# Altium schematic sheet gate_driver.SchDoc
size A4; Author: Omri Nissan; Organization: Altium Limited; Address1: -; Address2: San Luis Obispo; Address3: California, 93401; Address4: United States; DocumentNumber: 7; SheetNumber: 7; SheetTotal: 8
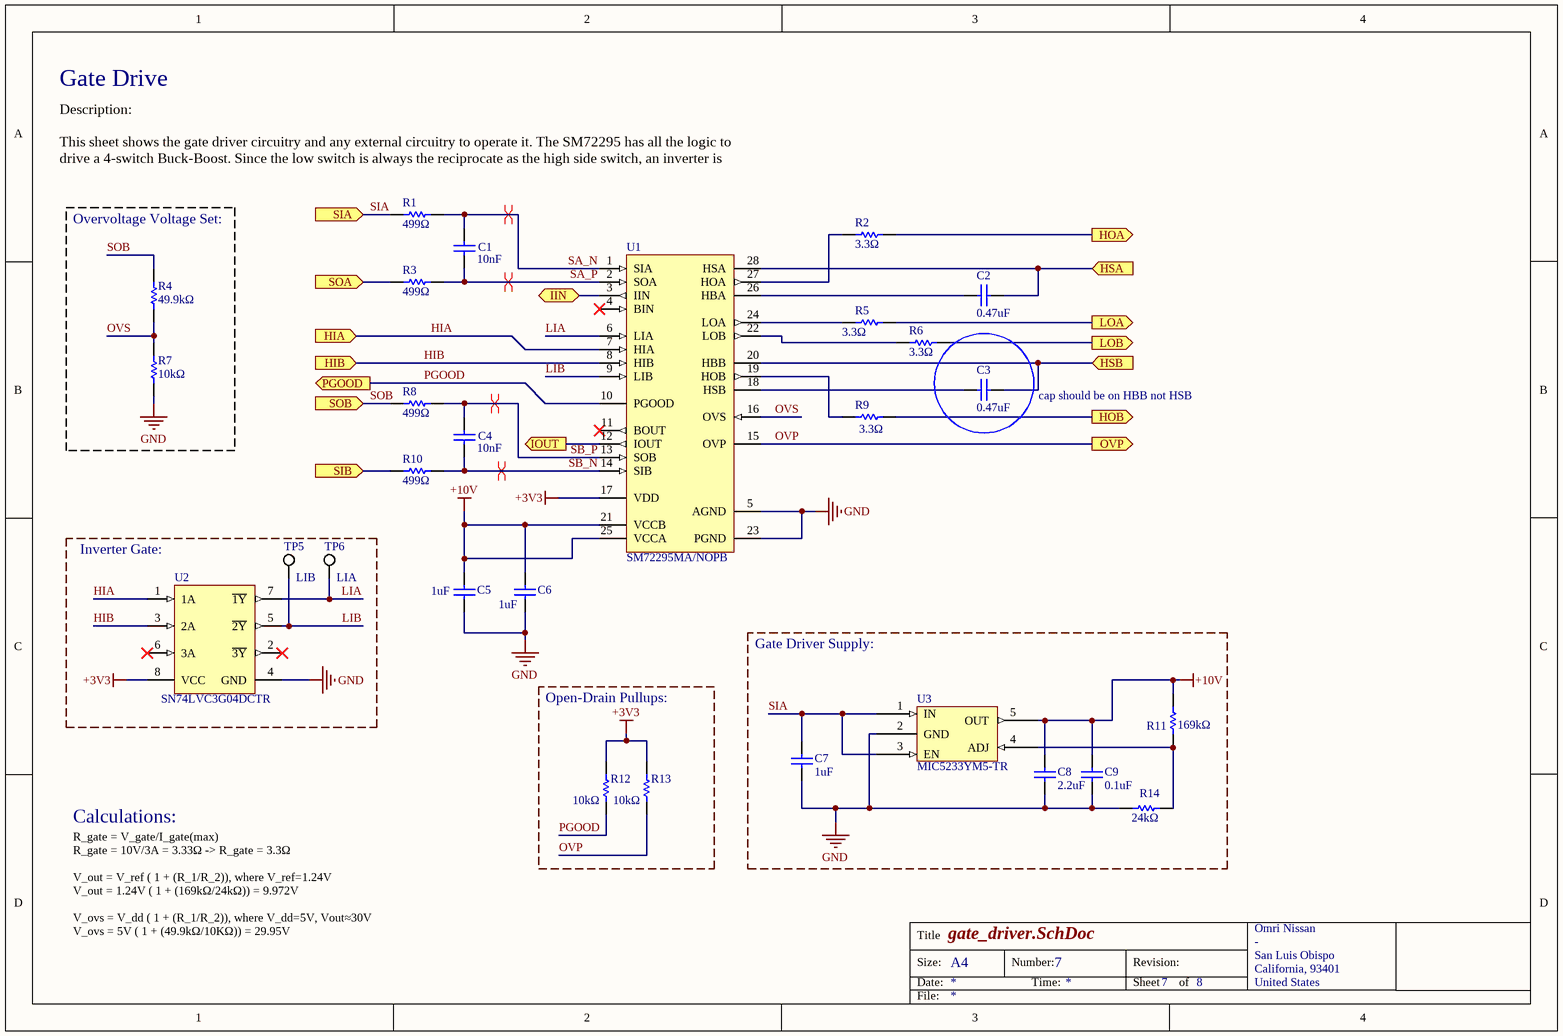
[diagram p0: gate_driver.SchDoc]

## Parts
C1  10nF  [CAPC1608X90X40ML10T20]
C2  0.47uF  [CAPC2013X110X50NL20T25]
C3  0.47uF  [CAPC2013X110X50NL20T25]
C4  10nF  [CAPC1608X90X40ML10T20]
C5  1uF  [CAPC1608X90X20LL10]
C6  1uF  [CAPC1608X90X20LL10]
C7  1uF  [CAPC1608X90X20LL10]
C8  2.2uF  [CAPC2013X145X20LL20]
C9  0.1uF  [CAPC1608X90X35ML10T15]
R1  499Ω  [RESC1608X55X30LL20T20]
R2  3.3Ω  [RESC1609X50X30LL10T20]
R3  499Ω  [RESC1608X55X30LL20T20]
R4  49.9kΩ  [RESC1608X55X30ML15T15]
R5  3.3Ω  [RESC1609X50X30LL10T20]
R6  3.3Ω  [RESC1609X50X30LL10T20]
R7  10kΩ  [RESC1609X55X30LL15T15]
R8  499Ω  [RESC1608X55X30LL20T20]
R9  3.3Ω  [RESC1609X50X30LL10T20]
R10  499Ω  [RESC1608X55X30LL20T20]
R11  169kΩ  [RESC1608X55X30ML15T15]
R12  10kΩ  [RESC1609X55X30LL15T15]
R13  10kΩ  [RESC1609X55X30LL15T15]
R14  24kΩ  [RESC1609X50X30NL10T20]
TP5  LIB  [KSTN-5012_V]
TP6  LIA  [KSTN-5012_V]
U1  SM72295MA/NOPB  [DW0028A_N]
U2  SN74LVC3G04DCTR  [TI-DCT8_V]
U3  MIC5233YM5-TR  [MF05A_L]

## Blocks framed on the sheet
Overvoltage Voltage Set:: R4 R7
Inverter Gate:: TP5 TP6 U2
Gate Driver Supply:: C7-C9 R11 R14 U3
Open-Drain Pullups:: R12 R13

## Ports
HIA (in), HIB (in), HOA (out), HOB (out), HSA (in), HSB (in), IIN (bidir), IOUT (out), LOA (out), LOB (out), OVP (out), PGOOD (out), SIA (in), SIB (in), SOA (in), SOB (in)

## Nets
+3V3: R12.2 R13.2 U1.17(VDD) U2.8(VCC)
+10V: C5.1 C6.1 C8.2 C9.2 R11.2 U1.21(VCCB) U1.25(VCCA) U3.5(OUT)
GND: C5.2 C6.2 C7.2 C8.1 C9.1 R7.1 R14.2 U1.5(AGND) U1.23(PGND) U2.4(GND) U3.2(GND)
HIA: U1.7(HIA) U2.1(1A) ; port HIA
HIB: U1.8(HIB) U2.3(2A) ; port HIB
HOA: R2.2 ; port HOA
HOB: R9.2 ; port HOB
HSA: C2.2 U1.28(HSA) ; port HSA
HSB: C3.2 U1.20(HBB) ; port HSB
IIN: U1.3(IIN) ; port IIN
IOUT: U1.12(IOUT) ; port IOUT
LIA: TP6.1 U1.6(LIA) U2.7(~{1Y})
LIB: TP5.1 U1.9(LIB) U2.5(~{2Y})
LOA: R5.2 ; port LOA
LOB: R6.2 ; port LOB
OVP: R13.1 U1.15(OVP) ; port OVP
OVS: R4.1 R7.2 U1.16(OVS)
PGOOD: R12.1 U1.10(PGOOD) ; port PGOOD
SA_N: C1.2 R1.2 U1.1(SIA)
SA_P: C1.1 R3.2 U1.2(SOA)
SB_N: C4.1 R10.2 U1.14(SIB)
SB_P: C4.2 R8.2 U1.13(SOB)
SIA: C7.1 R1.1 U3.1(IN) U3.3(EN) ; port SIA
SIB: R10.1 ; port SIB
SOA: R3.1 ; port SOA
SOB: R4.2 R8.1 ; port SOB
NetC2_1: C2.1 U1.26(HBA)
NetC3_1: C3.1 U1.18(HSB)
NetR2_1: R2.1 U1.27(HOA)
NetR5_1: R5.1 U1.24(LOA)
NetR6_1: R6.1 U1.22(LOB)
NetR9_1: R9.1 U1.19(HOB)
NetR11_1: R11.1 R14.1 U3.4(ADJ)

Not connected (* = marked no-connect by the designer): U1 4(BIN)* 11(BOUT)*; U2 2(~{3Y})* 6(3A)*

## Layout directives
differential pair: SA_N, SA_P, SB_N, SB_P

## Notes on the sheet
- Gate Drive
- Description:
  This sheet shows the gate driver circuitry and any external circuitry to operate it. The SM72295 has all the logic to drive a 4-switch Buck-Boost. Since the low switch is always the reciprocate as the high side switch, an inverter is used to drive the low side switches.
- (near C3) cap should be on HBB not HSB
- Calculations:
- R_gate = V_gate/I_gate(max)
  R_gate = 10V/3A = 3.33Ω -> R_gate = 3.3Ω
  V_out = V_ref ( 1 + (R_1/R_2)), where V_ref=1.24V
  V_out = 1.24V ( 1 + (169kΩ/24kΩ)) = 9.972V
  V_ovs = V_dd ( 1 + (R_1/R_2)), where V_dd=5V, Vout≈30V
  V_ovs = 5V ( 1 + (49.9kΩ/10KΩ)) = 29.95V
- Title
- Size:
- Date:
- A4
- Number:
- Time:
- Revision:
- Sheet
- of
- File:

## Library data of the parts
C1 C4 = CMP-2100-03600-1: CC0603KRX7R9BB103 - Chip Capacitor, 10 nF, +/- 10%, 50 V, -55 to 125 degC, 0603 (1608 Metric), RoHS, Tape and Reel; Manufacturer: Yageo; Insulation Resistance: 100GR; Dielectric: X7R; Voltage Rating (DC): 50V; Material: Ceramic; Lead Free: LeadFree; Case/Package: 0603; Datasheet Version: Rev. 15, 10/2016; Composition: Ceramic; Radiation Hardening: No; Thickness: 0.035inch; RoHSCompliant: True; Termination: SMD/SMT; Capacitance: 10nF; Manufacturer URL: http://www.yageo.com/; Tolerance: 10%; REACH SVHC: NoSVHC; Voltage: 50V; Max Operating Temperature: 125degC; Case Code (Metric): 1608; Package Quantity: 1; Case Code (Imperial): 0603; Packaging: TapeandReel; Package Reference: 0603; Width: 0.031inch; Datasheet URL: http://www.yageo.com/documents/recent/UPY-GPHC_X7R_6.3V-to-50V_15.pdf; Length: 1.6mm; Min Operating Temperature: -55degC; Number of Pins: 2; Depth: 0.8mm; Mount: SurfaceMount; Height: 0.8mm; Voltage Rating: 50V; Package Description: 2-Pin Surface Mount Device, Body 1.6 x 0.8 mm
C2 C3 = CMP-2007-03659-1: C0805C474K5RACTU; Manufacturer: Kemet; Part Number: C0805C474K5RACTU
C5-C7 = CMP-2000-06025-1: C1608X5R1H105K080AB- Chip Capacitor, 1 uF, +/- 10%, 50 V, -55 to 85 degC, 0603 (1608 Metric), RoHS, Tape and Reel; Manufacturer: TDK; PCN Part Number: MLCCPartNumberChange30/Nov/2012; Other Names: 445-7468-6; Online Catalog: CSeries,GeneralPurpose; Capacitance: 1µF; Product Training Modules: CSeriesGeneralApplicationsSEAT,CCV,andTVCLDesignToolsGuidetoReplacinganElectrolyticCapacitorwithanMLCC; Voltage - Rated: 50V; Design Resources: 20WNon-IsolatedBuckLEDDriverUsingPLLNK460KG; Temperature Coefficient: X5R; Series: C; Datasheet Version: 08/2016; Package Description: 2-Pin Surface Mount Device, Body 1.6 x 0.8 mm; Mounting Technology: SurfaceMount; Features: -; Size / Dimension: 0.063"Lx0.031"W(1.60mmx0.80mm); Lead Spacing: -; Operating Temperature: -55°C~85°C; Tolerance: ±10%; Height - Seated (Max): -; Mounting Type: SurfaceMount,MLCC; Ratings: -; Standard Package: 1; Applications: GeneralPurpose; Datasheet URL: https://product.tdk.com/info/en/catalog/datasheets/mlcc_commercial_general_en.pdf; Category: Capacitors; Lead Style: -; Packaging: Digi-Reel®; RoHS Information: RoHSCertificate-MLCC; Package / Case: 0603(1608Metric); Package Reference: 0603; Manufacturer URL: http://www.tdk.com/; Thickness (Max): 0.035"(0.90mm); Family: CeramicCapacitors
C8 = CMP-2000-06040-1: C2012X7R1H225K125AC -Chip Capacitor, 2.2 uF, +/- 10%, 50 V, -55 to 125 degC, 0805 (2012 Metric), RoHS, Tape and Reel; Manufacturer: TDK; PCN Part Number: MLCCPartNumberChange30/Nov/2012; Other Names: 445-5968-1; Temperature Coefficient: X7R; Catalog Drawings: CSERIES_2012-0805_1.45; Kits: 445-9015-KIT-ND-KITMLCC1000PF-47UF080510-50V445-9003-KIT-ND-KITCAPCERHICAPMLCCSMD445-173086-KIT-ND-C0402-2220X7R6.3-50V1,000PF-; Online Catalog: CSeries,GeneralPurpose; Voltage - Rated: 50V; Capacitance: 2.2µF; Product Training Modules: CSeriesGeneralApplicationsSEAT,CCV,andTVCLDesignToolsGuidetoReplacinganElectrolyticCapacitorwithanMLCC; Operating Temperature: -55°C~125°C; Features: -; Tolerance: ±10%; Datasheet URL: https://datasheet.ciiva.com/24216/c2012x7r1h225k125ac-265016-24216364.pdf; Lead Style: -; Size / Dimension: 0.079"Lx0.049"W(2.00mmx1.25mm); Mounting Technology: SurfaceMount; Package Reference: 0805; Thickness (Max): 0.057"(1.45mm); RoHS Information: RoHSCertificate-MLCC; Height - Seated (Max): -; Manufacturer URL: http://www.tdk.com/; Standard Package: 1; Category: Capacitors; Package Description: 2-Pin Surface Mount Device, Body 2 x 1.25 mm; Packaging: CutTape(CT); Series: C; Applications: GeneralPurpose; Package / Case: 0805(2012Metric); Ratings: -; Datasheet Version: 09/2013; Family: CeramicCapacitors; Mounting Type: SurfaceMount,MLCC; Lead Spacing: -
C9 = CMP-2100-03643-1: GRM188R71H104KA93D - Chip Capacitor, 0.1 uF, +/- 10%, 50 V, -55 to 125 degC, 0603 (1608 Metric), RoHS, Tape and Reel; Manufacturer: Murata; Dielectric Material: Ceramic; Voltage Rating: 50V; Capacitance: 100nF; Dielectric: X7R; Insulation Resistance: 10GR; Case Code (Metric): 1608; Lead Free: LeadFree; Depth: 0.8mm; Number of Pins: 2; Radiation Hardening: No; Case/Package: 0603; Manufacturer URL: http://www.murata.com/; Packaging: TapeandReel; Length: 1.6mm; Contact Plating: Tin; Datasheet URL: http://psearch.en.murata.com/capacitor/product/GRM188R71H104KA93%23.pdf; Tolerance: 10%; Case Code (Imperial): 0603; Min Operating Temperature: -55degC; RoHSCompliant: true; Voltage: 50V; Termination: SMD/SMT; Mount: SurfaceMount; Material: Ceramic; Package Quantity: 1; Height: 0.8mm; Thickness: 0.035inch; REACH SVHC: NoSVHC; Max Operating Temperature: 125degC; Width: 0.8mm; Package Reference: 0603; Voltage Rating (DC): 50V; Datasheet Version: 42675.0; Package Description: 2-Pin Surface Mount Device, Body 1.6 x 0.8 mm
R1 R3 R8 R10 = CMP-2000-00076-1: ERA3AEB4990V; Manufacturer: Panasonic; Part Number: ERA3AEB4990V
R2 R5 R6 R9 = CMP-2000-03327-1: CRCW06033R30FNEA; Manufacturer: Vishay Dale; Part Number: CRCW06033R30FNEA
R4 = CMP-2000-00536-1: ERJ-3EKF4992V; Manufacturer: Panasonic; Part Number: ERJ-3EKF4992V
R7 R12 R13 = CMP-2000-07452-1: ERJ3EKF1002V - Chip Resistor, 10 KOhm, +/- 1%, 0.1 W, -55 to 155 degC, 0603 (1608 Metric), RoHS, Tape and Reel; Manufacturer: Panasonic; Voltage Rating: 75V; Case\/Package: 0603; Power Rating: 100mW; Resistance: 10KOhm; Temperature Coefficient: 100ppm\/degreesC; Number of Pins: 2; Package Reference: 603; Depth: 0.8mm; Mount: SurfaceMount; Package Description: 2-Pin Surface Mount Device, Body 1.6 x 0.85 mm; Datasheet Version: 02/2017; Length: 1.6mm; Lead Free: LeadFree; Height: 0.45mm; Number of Terminations: 2; Max Power Dissipation: 100mW; Min Operating Temperature: -55degC; Datasheet URL: https://industrial.panasonic.com/cdbs/www-data/pdf/RDA0000/AOA0000C304.pdf; Termination: SMD/SMT; Case Code (Metric): 1608; Case Code (Imperial): 0603; Tolerance: 1%; Max Operating Temperature: 155degC; RoHSCompliant: true; Voltage Rating (DC): 75V; Radiation Hardening: No; Packaging: TapeandReel; Composition: ThickFilm; Mounting Technology: SurfaceMount; Manufacturer URL: http://www.panasonic.com/; Width: 0.031inch; REACH SVHC: NoSVHC; Contact Plating: Tin; Military Standard: Not; Package Quantity: 1
R11 = CMP-2000-00284-1: ERJ-3EKF1693V; Manufacturer: Panasonic; Part Number: ERJ-3EKF1693V
R14 = CMP-2000-03118-1: CRCW060324K0FKEA; Manufacturer: Vishay Dale; Part Number: CRCW060324K0FKEA
TP5 TP6 = CMP-1672-00004-4: Test Point, White, Through Hole, RoHS, Bulk; Manufacturer: Keystone; DatasheetVersion: Rev. F, 12/2013; ComponentLink1URL: http://www.keyelco.com/; PackageReference: 5012; RoHSCompliant: true; ComponentLink2Description: Datasheet; Colour: White; Contact Material: Bronze; PackageDescription: 1-Pin Through Hole Device, Dia 3.17 mm; Mounting Technology: Through Hole; Mount: Through Hole; Package Quantity: 100; ComponentLink1Description: Manufacturer URL; Pins: 1; Height: 8.12 mm; Packaging: Bulk; REACH SVHC: No SVHC; Contact Plating: Silver; Length: 11.3 mm; ComponentLink2URL: http://www.keyelco.com/product-pdf.cfm?p=1321
U1 = CMP-0058-01418-2: Photovoltaic Full Bridge Driver, 28-pin Wide SOIC, 26 Rail; Manufacturer: Texas Instruments; CompType: Interface IC; PackageTopMarking: NSUZXYTTE#*S72295; PowerWise: N; High-Reliability: Y; ComponentLink1Description: Datasheet URL; ComponentLink1URL: http://www.ti.com/general/docs/lit/getliterature.tsp?genericPartNumber=SM72295&fileType=pdf; PackageDescription: Molded Package, S.O., .300in Wide, 28 Lead; PinCount: 28; PartNumber: SM72295MA/NOPB; PackageReference: DW0028A; RoHS: Y
U2 = CMP-0859-00002-1: Triple Inverter Gate, 1.65 to 5.5 V, -40 to 125 degC, 8-Pin DCT, Green (RoHS & no Sb/Br), Tape and Reel; Manufacturer: Texas Instruments; VCC (Max): 5.5 V; tpd @ Nom Voltage (Max): 4.1 ns; ICC @ Nom Voltage (Max): 0.01 mA; F @ Nom Voltage (Max): 150 MHz; Bits: 3; VCC (Min): 1.65 V; PackageDescription: 8-Pin Plastic Small Outline, Body 2.95 x 2.8 mm, Pitch 0.65 mm; Mounting Technology: Surface Mount; ComponentLink2URL: http://www.ti.com/lit/ds/symlink/sn74lvc3g04.pdf; PartNumber: SN74LVC3G04DCTR; ComponentLink2Description: Datasheet; Packing: Tape and Reel; ComponentLink1URL: http://www.ti.com/; DatasheetVersion: SCES363L; ComponentLink1Description: Manufacturer URL; RoHS: TRUE; Operating Temperature Range: -40 to 125 degC; PackageReference: DCT-8
U3 = MIC5233YM5-TR_1: IC REG LDO ADJ .1A SOT23-5; Manufacturer 1: Microchip Micrel; Max Input Voltage: 36V; Min Input Voltage: 2.3V; Output Voltage: 20V; Output Type: Adjustable; Dropout Voltage: 270mV; Max Output Current: 100mA; Number of Outputs: 1; Min Output Voltage: 1.24V; Polarity: Positive; Output Voltage Accuracy: 1%; Supplier 1: Digi-Key; Manufacturer Part Number 1: MIC5233YM5-TR; Stock 1: 13352; Pricing 1: 1=1.20000, 25=1.00000, 100=0.91000 (USD); RoHS: Yes; Mount: Surface Mount; Case/Package: SOT-23; Number of Pins: 5; Min Operating Temperature: -40°C; Max Operating Temperature: 125°C; Packaging: Tape and Reel; Output Current: 100mA; Number of Regulators: 1; Max Output Voltage: 20V; Package Quantity: 1; Radiation Hardening: No; REACH SVHC: No SVHC; ComponentLink1URL: https://datasheet.ciiva.com/2044/mic5233-2044736.pdf?src-supplier=Digi-Key; ComponentLink1Description: https://datasheet.ciiva.com/2044/mic5233-2044736.pdf?src-supplier=Digi-Key; ComponentLink2URL: https://datasheet.ciiva.com/16374/mic5233-16374581.pdf?src-supplier=Future+Electronics; ComponentLink2Description: https://datasheet.ciiva.com/16374/mic5233-16374581.pdf?src-supplier=Future+Electronics; ComponentLink3URL: https://datasheet.ciiva.com/23773/1670787-23773077.pdf?src-supplier=Newark; ComponentLink3Description: https://datasheet.ciiva.com/23773/1670787-23773077.pdf?src-supplier=Newark; ComponentLink4URL: https://datasheet.ciiva.com/13026/mic5233-13026150.pdf?src-supplier=Mouser; ComponentLink4Description: https://datasheet.ciiva.com/13026/mic5233-13026150.pdf?src-supplier=Mouser; ComponentLink5URL: https://datasheet.ciiva.com/26890/getdatasheetpartid-111208-26890058.pdf?src-supplier=Verical; ComponentLink5Description: https://datasheet.ciiva.com/26890/getdatasheetpartid-111208-26890058.pdf?src-supplier=Verical; ComponentLink6URL: https://datasheet.ciiva.com/2044/mic5233-2044734.pdf?src-supplier=Digi-Key; ComponentLink6Description: https://datasheet.ciiva.com/2044/mic5233-2044734.pdf?src-supplier=Digi-Key; ComponentLink7URL: https://datasheet.ciiva.com/7993/1670787-7993422.pdf?src-supplier=Element14; ComponentLink7Description: https://datasheet.ciiva.com/7993/1670787-7993422.pdf?src-supplier=Element14; ComponentLink8URL: https://datasheet.ciiva.com/2044/mic5233-2044735.pdf?src-supplier=Digi-Key; ComponentLink8Description: https://datasheet.ciiva.com/2044/mic5233-2044735.pdf?src-supplier=Digi-Key; ComponentLink9URL: https://datasheet.ciiva.com/23772/1670787-23772959.pdf?src-supplier=Newark; ComponentLink9Description: https://datasheet.ciiva.com/23772/1670787-23772959.pdf?src-supplier=Newark; Supplier Part Number 1: 576-1507-1-ND